# EAGLE design RaspiLink (EAGLE 7.2.0)
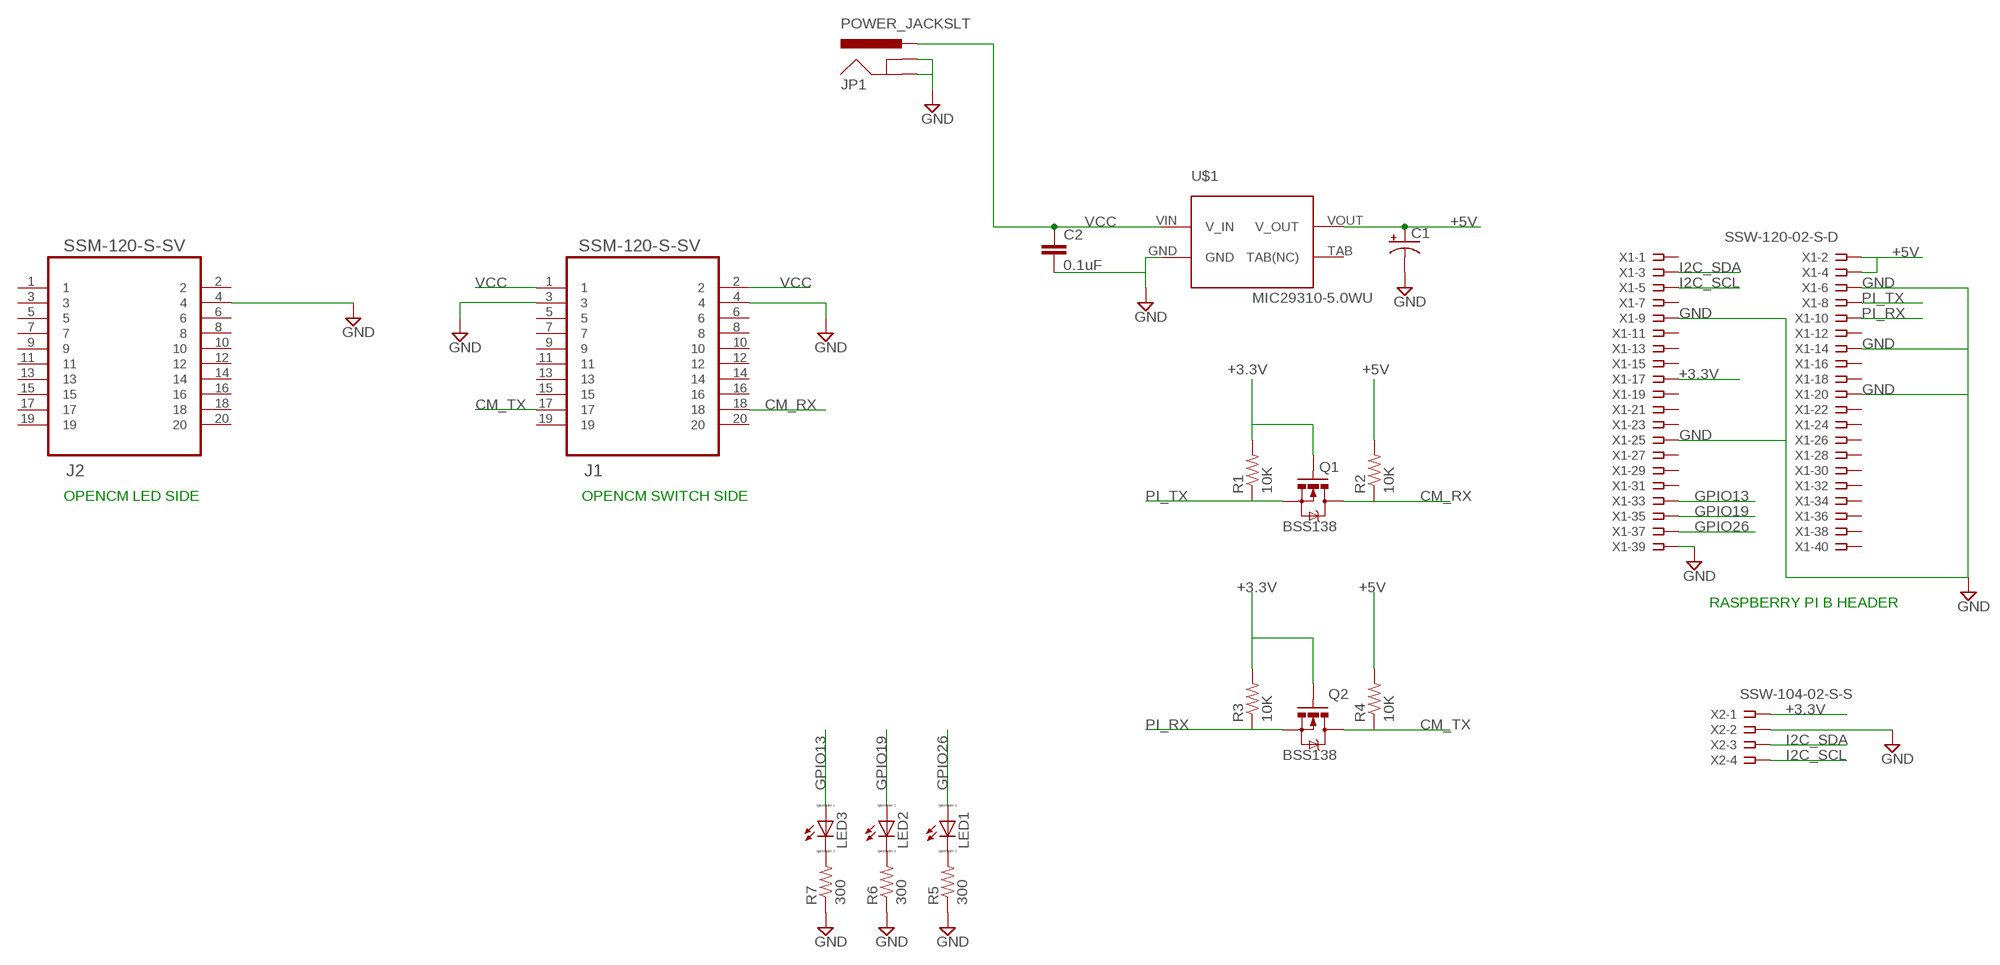
[diagram p0: schematic, sheet 1]

## Parts
C1  100UF-25V-20%(PTH)  [CPOL-RADIAL-100UF-25V]
C2  0.1uF  0.1UF-25V-5%(0603)  [0603-CAP]
J1  SSM-120-S-SV  [SAMTEC_SSM-120-S-SV]
J2  SSM-120-S-SV  [SAMTEC_SSM-120-S-SV]
JP1  POWER_JACKSLT  [POWER_JACK_SLOT]
LED1  LED_ELD260  [LED_LD260]
LED2  LED_ELD260  [LED_LD260]
LED3  LED_ELD260  [LED_LD260]
Q1  MOSFET-NCHANNELBSS123LT1G  [SOT23-3]
Q2  MOSFET-NCHANNELBSS123LT1G  [SOT23-3]
R1  10K  RESISTOR0603-RES  [0603-RES]
R2  10K  RESISTOR0603-RES  [0603-RES]
R3  10K  RESISTOR0603-RES  [0603-RES]
R4  10K  RESISTOR0603-RES  [0603-RES]
R5  300  RESISTOR0603-RES  [0603-RES]
R6  300  RESISTOR0603-RES  [0603-RES]
R7  300  RESISTOR0603-RES  [0603-RES]
U$1  MIC29310-5.0WU  [TO-263-3]
X1  SSW-120-02-S-D  [SSW-120-02-S-D]
X2  SSW-104-02-S-S  [SSW-104-02-S-S]

## Nets
+3.3V: Q1.1(G) Q2.1(G) R1.2 R3.2 X1.17 X2.1
+5V: C1.1(+) R2.2 R4.2 U$1.VOUT(V_OUT) X1.2 X1.4
CM_RX: J1.18 Q1.3(D) R2.1
CM_TX: J1.17 Q2.3(D) R4.1
GND: C1.2(-) C2.2 J1.3 J1.4 J2.4 JP1.GND@1(GNDBREAK) JP1.GND@2(GND) R5.1 R6.1 R7.1 U$1.GND X1.6 X1.9 X1.14 X1.20 X1.25 X1.39 X2.2
GPIO13: LED3.A X1.33
GPIO19: LED2.A X1.35
GPIO26: LED1.A X1.37
I2C_SCL: X1.5 X2.4
I2C_SDA: X1.3 X2.3
N$17: LED1.K(C) R5.2
N$18: LED2.K(C) R6.2
N$19: LED3.K(C) R7.2
PI_RX: Q2.2(S) R3.1 X1.10
PI_TX: Q1.2(S) R1.1 X1.8
VCC: C2.1 J1.1 J1.2 JP1.PWR U$1.VIN(V_IN)
Unconnected: J1.5 J1.6 J1.7 J1.8 J1.9 J1.10 J1.11 J1.12 J1.13 J1.14 J1.15 J1.16 J1.19 J1.20 J2.1 J2.2 J2.3 J2.5 J2.6 J2.7 J2.8 J2.9 J2.10 J2.11 J2.12 J2.13 J2.14 J2.15 J2.16 J2.17 J2.18 J2.19 J2.20 U$1.TAB(TAB(NC)) X1.1 X1.7 X1.11 X1.12 X1.13 X1.15 X1.16 X1.18 X1.19 X1.21 X1.22 X1.23 X1.24 X1.26 X1.27 X1.28 X1.29 X1.30 X1.31 X1.32 X1.34 X1.36 X1.38 X1.40

## Notes on the sheet
- OPENCM LED SIDE | OPENCM SWITCH SIDE
- RASPBERRY PI B HEADER

## Library data of the parts
C1 = SparkFun-Capacitors:100UF-25V-20%(PTH): CAP-08439; PROD_ID: CAP-08439
C2 = SparkFun-Capacitors:0.1UF-25V-5%(0603): CAP-08604; PROD_ID: CAP-08604
J1 J2 = SAMTEC-FLE-Mxx-Sxx_By_element14_Batch_1:SSM-120-S-SV: .025 SOCKET STRIPS , 20POS; MPN: SSM-120-S-SV; OC_FARNELL: -; OC_NEWARK: 11P7987; PACKAGE: .025 SOCKET STRIPS , 20POS; SUPPLIER: SAMTEC
JP1 = SparkFun-Connectors:POWER_JACK: Power Jack This is the standard 5.5mm barrel jack for power. The PTH is the most common, proven, reliable, footprint. The Slot footprint only works if the mill layer is transmitted to the PCB fab house so be warned. Mating wall wart : TOL-00298 (and others); PROD_ID: PRT-00119
LED1-LED3 = eagle-ltspice:LED_E: LED Source: http://www.osram.convergy.de Source: www.luxeon.com Source: www.kingbright.com; SPICEMODEL: NONE; SPICEPREFIX: D; SPICETYPE: diode
Q1 Q2 = SparkFun-DiscreteSemi:MOSFET-NCHANNEL: Common NMOSFET Parts MFG P/N Store ID Prod ID FDD8780 TRANS-09984 SI7820DN TRANS-11055 FDS6630A IC-08089 2N7002PW TRANS-11151 FQP30N06L COM-10213 TRANS-10060 BSS123LT1G TRANS-08345 BSS138 TRANS-00830 BS170 2N7000; PROD_ID: BSS138
R1-R7 = SparkFun-Passives:RESISTOR: Resistor Basic schematic elements and footprints for 0603, 1206, and PTH resistors.
U$1 = Micrel_By_element14_Batch_1:MIC29310-5.0WU
X1 = con-samtec:SSW-120-02-S-D: THROUGH-HOLE .025" SQ POST SOCKET Source: Samtec SSW.pdf; MPN: SSW-120-02-S-D; OC_FARNELL: unknown; OC_NEWARK: 11P9639
X2 = con-samtec:SSW-104-02-S-S: THROUGH-HOLE .025" SQ POST SOCKET Source: Samtec SSW.pdf; MPN: SSW-104-02-S-S; OC_FARNELL: unknown; OC_NEWARK: 11P9384

## Board
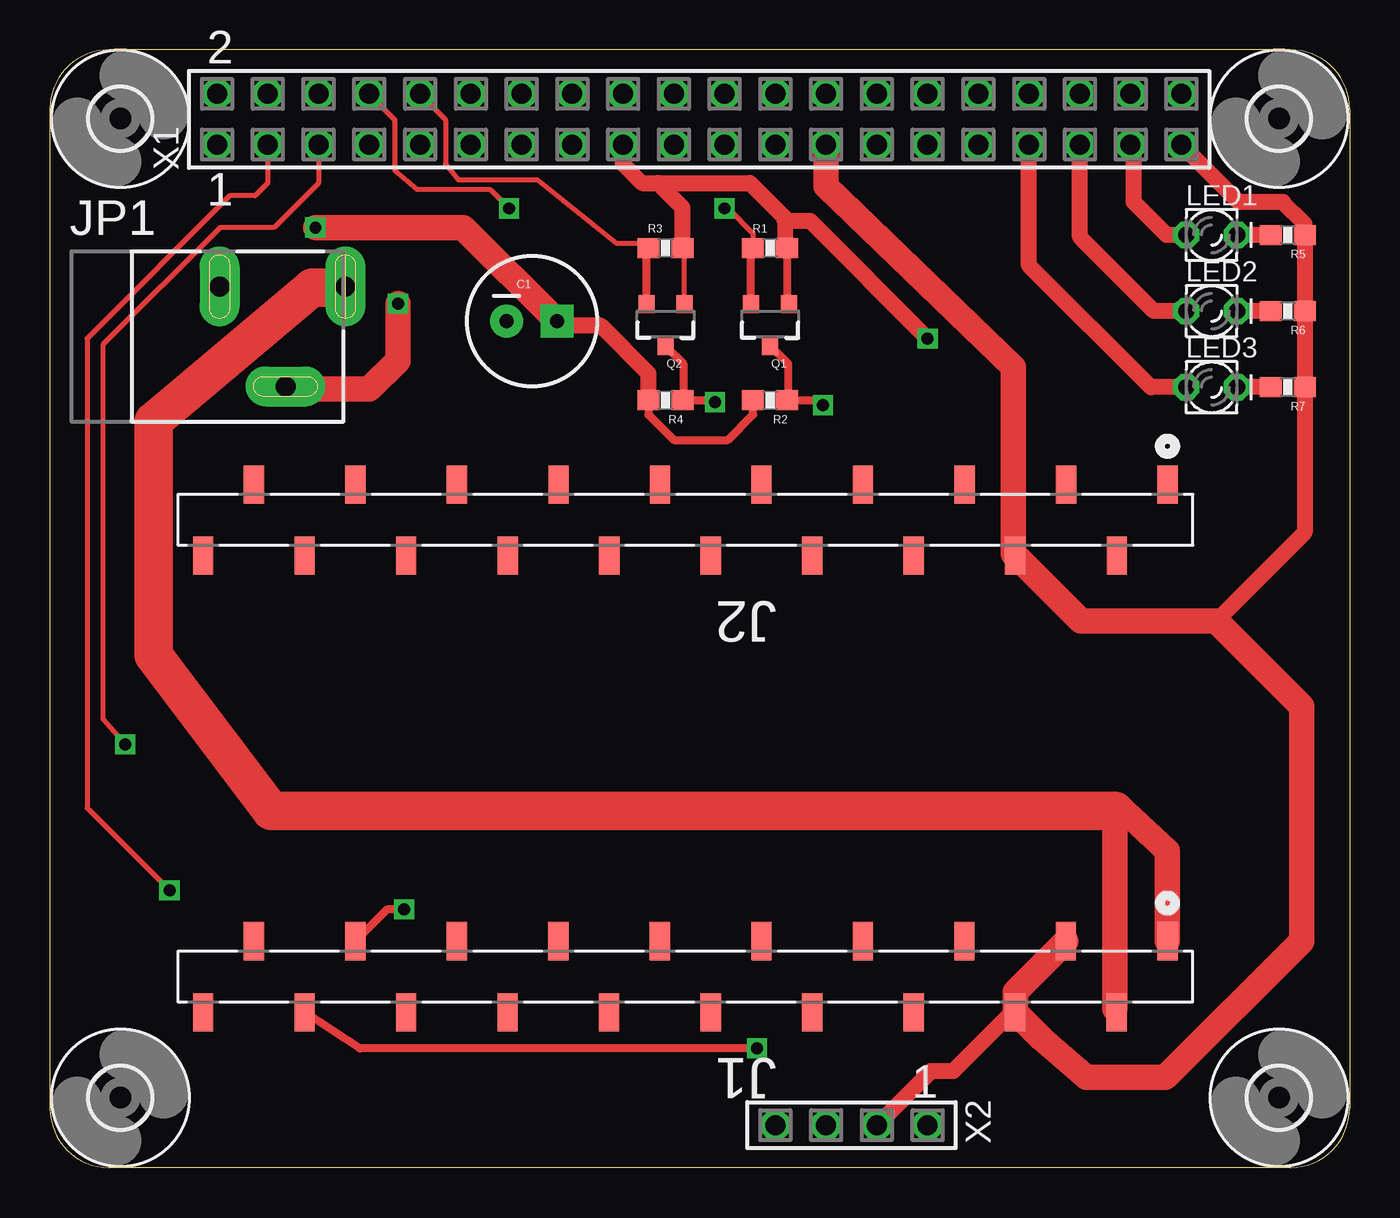
[diagram p1: board, top side]
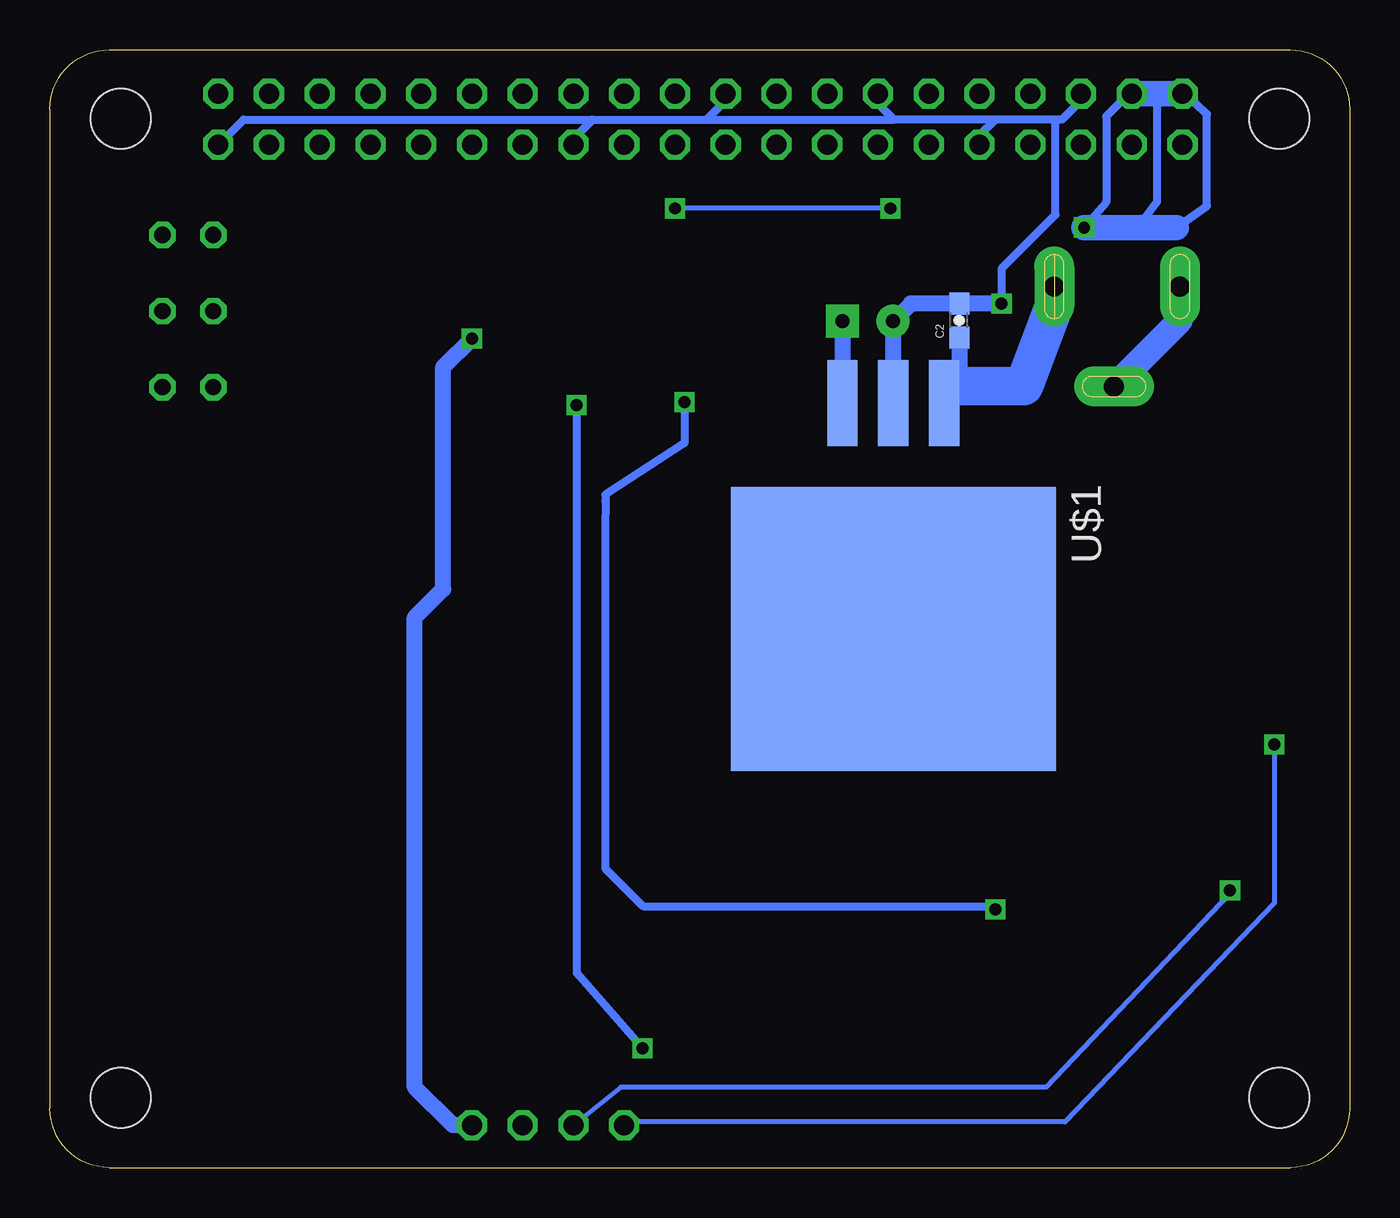
[diagram p2: board, bottom side, seen from below]

Size 65.04 x 55.94 mm. Coordinates in mm from the lower left corner, seen from the top.
Outline: 0,52.98 0,2.97 arc90 2.96,0 62.07,0 arc90 65.04,2.97 65.04,52.98
Outline: 0,52.97 arc-90 2.96,55.94 62.07,55.94 arc-90 65.04,52.97
Copper layers (1*16): Top 0.035mm / dielectric 1.5mm / Bottom 0.035mm
Design rules "default": minimum track width 10mil, minimum drill 24mil, track to track 8mil, track to pad 8mil, pad to pad 8mil, via to via 8mil, smd to smd 8mil, copper to edge 40mil, drill to drill 8mil, minimum pad ring 10mil, minimum via ring 8mil, stop-mask expansion 4mil, vias tented up to drill 0mil, thermal gap 10mil

### Footprints (pad centres in the part's own frame; a part is rotated, then mirrored left to right if it is on the bottom)
CPOL-RADIAL-100UF-25V = drill 0.7 pad 1.651 square: 1 1.27,0 | drill 0.7 pad 1.651: 2 -1.27,0
0603-CAP = smd 1.1 x 1: 1 -0.85,0; 2 0.85,0
SAMTEC_SSM-120-S-SV = smd 1.016 x 1.905: 1 0,0; 2 2.54,3.556; 3 5.08,0; 4 7.62,3.556; 5 10.16,0; 6 12.7,3.556; 7 15.24,0; 8 17.78,3.556; 9 20.32,0; 10 22.86,3.556; 11 25.4,0; 12 27.94,3.556; 13 30.48,0; 14 33.02,3.556; 15 35.56,0; 16 38.1,3.556; 17 40.64,0; 18 43.18,3.556; 19 45.72,0; 20 48.26,3.556
POWER_JACK_SLOT = drill 1 pad 2 long: GND@1 2.58,7.5; GND@2 7.58,10.8; PWR 2.58,13.8
LED_LD260 = drill 0.813 octagon: A -1.27,0; K 1.27,0
SOT23-3 = smd 0.8 x 0.9: 1 -0.95,-1; 2 0.95,-1; 3 0,1.1
0603-RES = smd 1.1 x 1: 1 -0.85,0; 2 0.85,0
TO-263-3 = smd 4.318 x 1.524: GND -5.969,0; VIN -5.969,2.54; VOUT -5.969,-2.54 | smd 14.224 x 16.256: TAB 5.334,0
3,0 = hole 3: 0,0
SSW-120-02-S-D = drill 1 pad 1.5 octagon: 1 -24.13,-1.27; 2 -24.13,1.27; 3 -21.59,-1.27; 4 -21.59,1.27; 5 -19.05,-1.27; 6 -19.05,1.27; 7 -16.51,-1.27; 8 -16.51,1.27; 9 -13.97,-1.27; 10 -13.97,1.27; 11 -11.43,-1.27; 12 -11.43,1.27; 13 -8.89,-1.27; 14 -8.89,1.27; 15 -6.35,-1.27; 16 -6.35,1.27; 17 -3.81,-1.27; 18 -3.81,1.27; 19 -1.27,-1.27; 20 -1.27,1.27; 21 1.27,-1.27; 22 1.27,1.27; 23 3.81,-1.27; 24 3.81,1.27; 25 6.35,-1.27; 26 6.35,1.27; 27 8.89,-1.27; 28 8.89,1.27; 29 11.43,-1.27; 30 11.43,1.27; 31 13.97,-1.27; 32 13.97,1.27; 33 16.51,-1.27; 34 16.51,1.27; 35 19.05,-1.27; 36 19.05,1.27; 37 21.59,-1.27; 38 21.59,1.27; 39 24.13,-1.27; 40 24.13,1.27
SSW-104-02-S-S = drill 1 pad 1.5 octagon: 1 -3.81,0; 2 -1.27,0; 3 1.27,0; 4 3.81,0

### Placement (x,y rotation side)
C1  24.12,42.35 0 top
C2  19.53,42.4 90 bottom
J1  55.92,11.34 180 top
J2  55.93,34.2 180 top
JP1  0.98,46.68 270 top
LED1  58.13,46.68 0 top
LED2  58.13,42.87 0 top
LED3  58.13,39.06 0 top
Q1  36.04,42.22 180 top
Q2  30.8,42.22 180 top
R1  36.04,46.03 0 top
R2  36.04,38.41 180 top
R3  30.8,46.03 0 top
R4  30.8,38.41 180 top
R5  61.94,46.68 180 top
R6  61.94,42.87 180 top
R7  61.94,39.06 180 top
U$1  22.84,32.29 270 bottom
U$2  [3,0]  3.53,3.5 0 top
U$3  [3,0]  3.53,52.5 0 top
U$4  [3,0]  61.51,3.5 0 top
U$5  [3,0]  61.51,52.5 0 top
X1  32.49,52.47 0 top
X2  40.11,2.13 180 top

### Tracks (layer width: path | path; a pad name or v marks a point on that pad's centre or on a via)
+3.3V  (via drill 0.6)
  Top 0.254: 36.78,46.14 R1.2 | Q2.1 31.75,45.93 R3.2
  Top 0.406: R1.2 36.89,43.32 Q1.1
  Top 0.61: 36.78,47.53 36.78,47.37
  Top 0.813: X1.17 28.68,50.23 29.63,49.28 30.43,49.28 | 30.43,49.28 35.03,49.28 36.78,47.53 | 36.78,46.14 36.78,47.37 38.05,47.37 v43.92,41.5 | R3.2 31.65,48.05 30.43,49.28
  Bottom 0.813: X2.1 44.87,2.13 46.78,4.03 46.78,27.53 45.35,28.96 45.35,40.07 v43.92,41.5
+5V  (via drill 0.6)
  Top 0.406: R4.2 29.95,37.69 31.22,36.42 33.92,36.42 35.19,37.69 R2.2
  Top 0.813: R4.2 29.95,39.75 27.57,42.13 25.61,42.13 C1.1
  Top 1.27: v13.28,47.05 20.69,47.05 C1.1
  Bottom 0.406: X1.4 11.04,53.74 12.17,52.61 12.17,48.32 v13.28,47.05 | 8.5,53.74 9.63,53.56 9.63,48.32 10.58,47.05 | 8.68,47.05 7.13,48.12 7.13,52.72 8.2,53.72
  Bottom 0.813: C1.1 25.39,38.27 U$1.VOUT
  Bottom 1.27: 8.68,47.05 10.58,47.05 v13.28,47.05 | X1.4 8.5,53.74 X1.2
CM_RX  (via drill 0.6)
  Top 0.406: Q1.3 36.94,40.23 36.94,38.45 R2.1 38.44,38.41 v38.68,38.16 | v35.39,5.97 15.51,5.97 J1.18
  Bottom 0.406: v38.68,38.16 38.68,9.75 v35.39,5.97
CM_TX  (via drill 0.6)
  Top 0.406: Q2.3 31.7,40.23 31.7,38.45 R4.1 33.2,38.41 v33.29,38.32 | v17.73,12.92 16.87,12.92 J1.17
  Bottom 0.406: v33.29,38.32 33.29,36.26 37.24,33.68 37.24,33.37 37.25,31.97 37.25,14.99 35.35,13.08 17.89,13.08 v17.73,12.92
GND  (via drill 0.6)
  Top 0.406: R5.1 62.79,47.23
  Top 0.61: 11.92,38.96 JP1.GND@2
  Top 0.813: R5.1 R6.1 R7.1 62.79,31.79 58.37,27.37 | 62.79,47.23 61.7,48.32 59.49,48.32 X1.39 | J1.4 48.15,7.78 45.19,4.83 44.08,4.83 X2.2
  Top 1.27: J2.4 51.58,27.37 58.37,27.37 62.65,23.08 62.65,11.34 55.83,4.51 51.86,4.51 49.64,6.45 J1.4 48.3,8.8 J1.3 | v17.41,43.24 17.41,40.39 15.98,38.96 11.92,38.96
  Bottom 0.254: 14.71,52.29 14.71,52.45
  Bottom 0.406: X1.6 13.44,53.41 14.39,52.45 14.71,52.45 17.73,52.45 | 17.73,52.45 22.81,52.45 | X1.9 18.52,51.66 17.73,52.45 | X1.14 23.6,53.24 22.81,52.45 | X1.25 38.84,51.5 37.89,52.45 | 37.89,52.45 32.17,52.45 | 32.17,52.45 22.81,52.45 | X1.20 31.22,53.41 32.17,52.45 | X1.39 55.35,52.45 37.89,52.45 | 14.71,52.29 14.71,47.69 17.41,44.99 v17.41,43.24
  Bottom 0.61: C2.2
  Bottom 0.813: C2.2 21.95,43.25 C1.2 22.85,38.27 U$1.GND | v17.41,43.24 C2.2
  Bottom 1.27: JP1.GND@1 8.48,42.4 JP1.GND@2
GPIO13
  Top 0.813: LED3.A 55.09,39.06 49,45.15 X1.33
GPIO19
  Top 0.813: LED2.A 55.25,42.87 51.54,46.58 X1.35
GPIO26
  Top 0.813: LED1.A 55.89,46.68 54.24,48.32 54.24,51.04 X1.37
I2C_SCL  (via drill 0.6)
  Top 0.254: X1.5 13.44,49.27 11.22,47.05 8.52,47.05 2.65,41.18 2.65,22.45 v3.76,21.18
  Bottom 0.254: v3.76,21.18 3.76,13.24 14.24,2.29 36.14,2.29 X2.4
I2C_SDA  (via drill 0.6)
  Top 0.254: X1.3 10.9,49.27 10.27,48.64 9,48.64 1.85,41.5 1.85,18 v5.98,13.88
  Bottom 0.254: v5.98,13.88 5.98,13.72 15.19,4.03 36.46,4.03 X2.3
N$1
  Top 1.27: 38.84,51.18 38.84,49.12 48.21,40.07 48.21,30.7
N$17
  Top 0.813: R5.2 LED1.K
N$18
  Top 0.813: R6.2 LED2.K
N$19
  Top 0.813: R7.2 LED3.K
PI_RX
  Top 0.254: X1.10 19.79,52.45 19.79,50.23 20.43,49.44 24.4,49.44 28.36,46.26 29.72,46.26 R3.1
  Top 0.406: Q2.2 29.85,45.93 R3.1
PI_TX  (via drill 0.6)
  Top 0.254: X1.8 17.25,52.45 17.25,49.91 18.36,48.96 22.01,48.96 v22.97,48.01 | v33.76,48.01 33.92,48.01 35.19,46.74 R1.1
  Top 0.406: Q1.2 35.09,45.93 R1.1
  Bottom 0.254: v22.97,48.01 v33.76,48.01
VCC  (via drill 0.6)
  Top 0.406: J1.2 53.29,7.94
  Top 1.27: J1.1 55.92,15.84 53.45,18.16 53.29,17.84 53.29,7.94
  Top 1.93: 53.29,17.84 11.06,17.84 5.19,25.62 5.19,37.37 13.12,44.04 v14.72,44.04
  Bottom 0.61: 19.43,39.12 C2.1
  Bottom 0.813: C2.1 19.53,39.02
  Bottom 1.27: 19.53,39.02 U$1.VIN
  Bottom 1.778: 14.78,43.17 JP1.PWR v14.72,44.04
  Bottom 1.93: 14.78,43.17 16.3,39.12 19.43,39.12